# EAGLE schematic DAWA 6.1 (EAGLE 9.2.1)
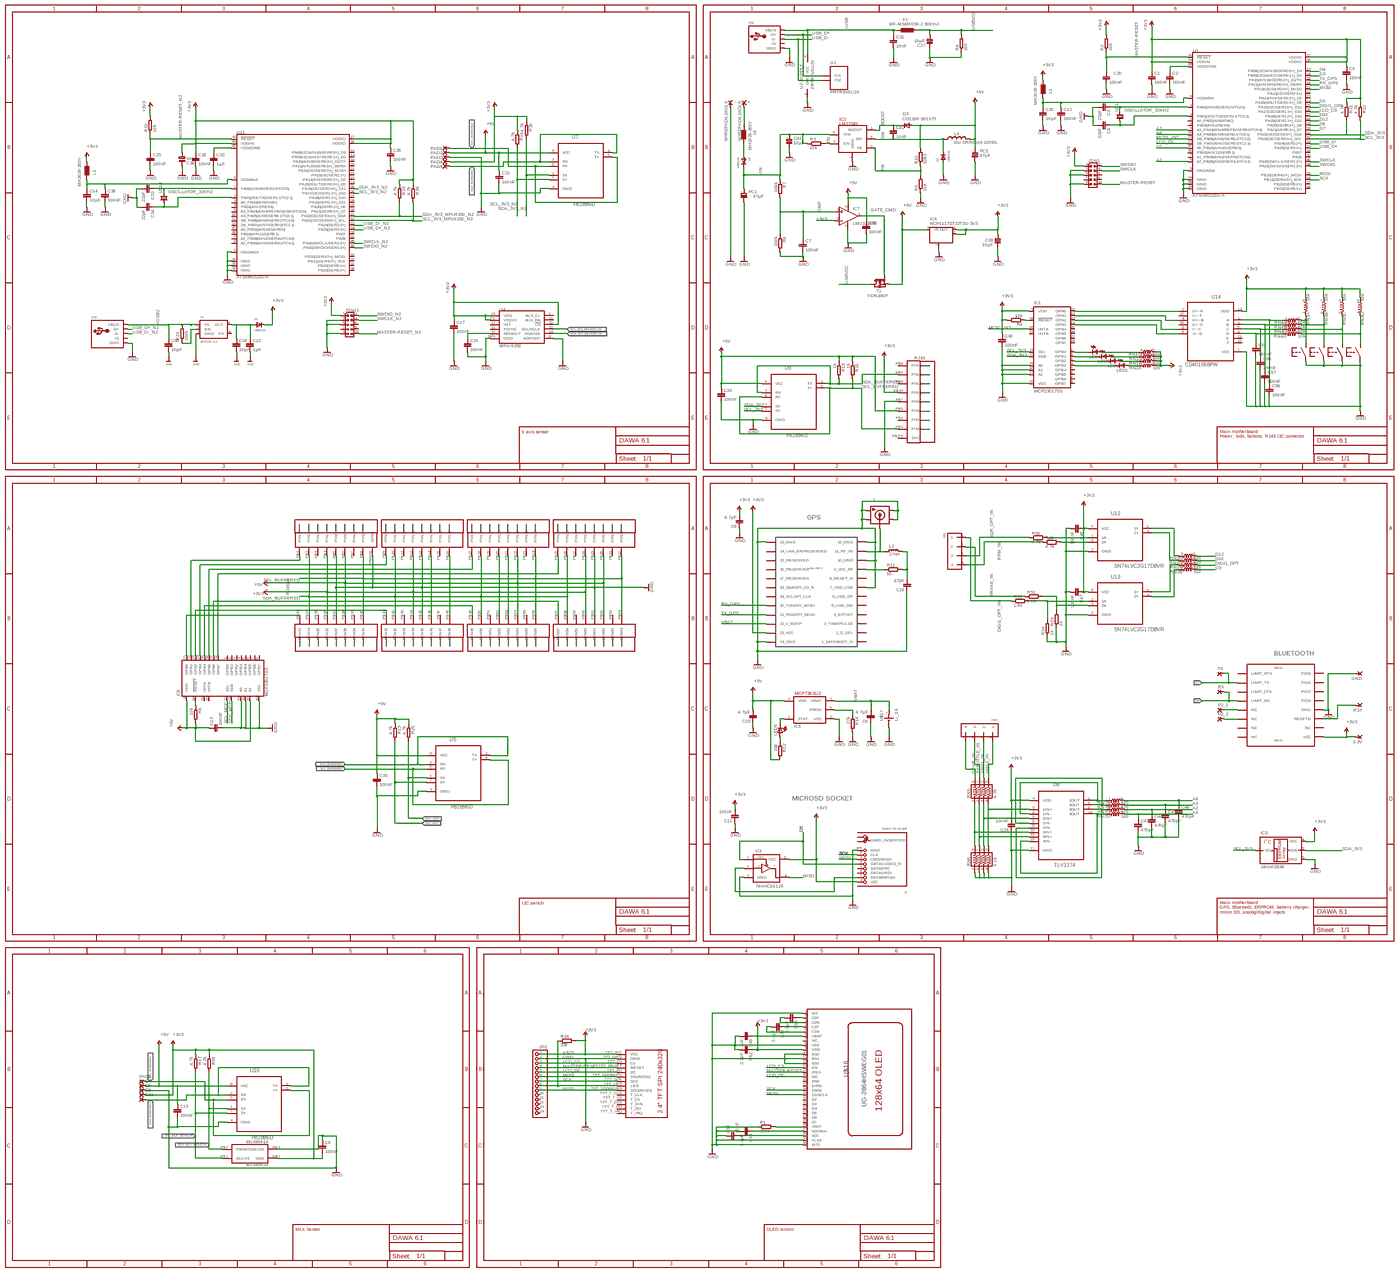
[diagram p0: schematic, sheet 1, overview]
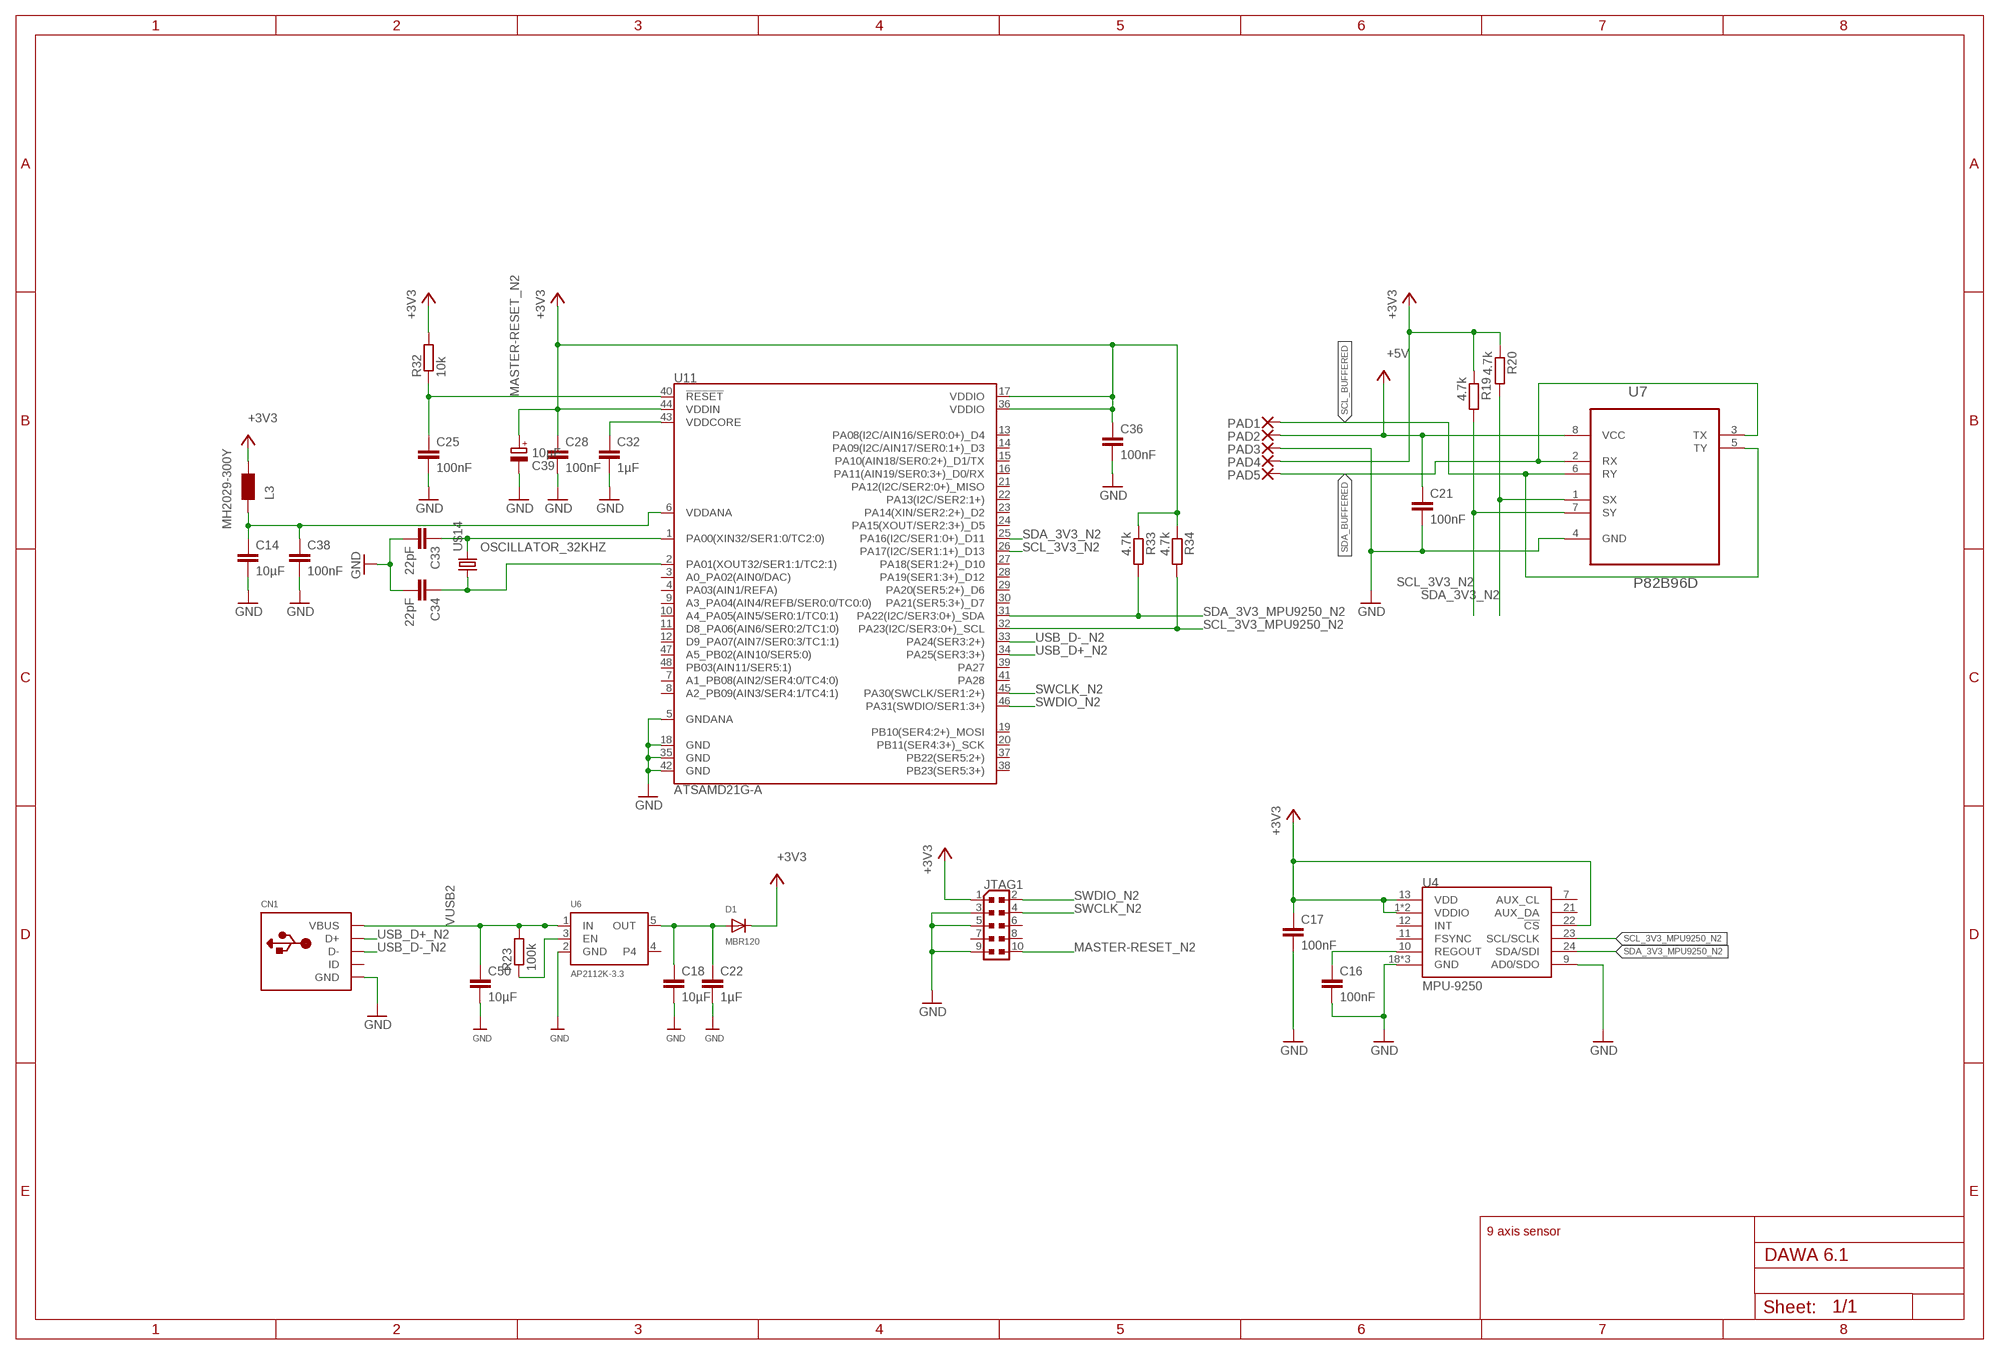
[diagram p1: schematic, sheet 1, part 1 of 4]
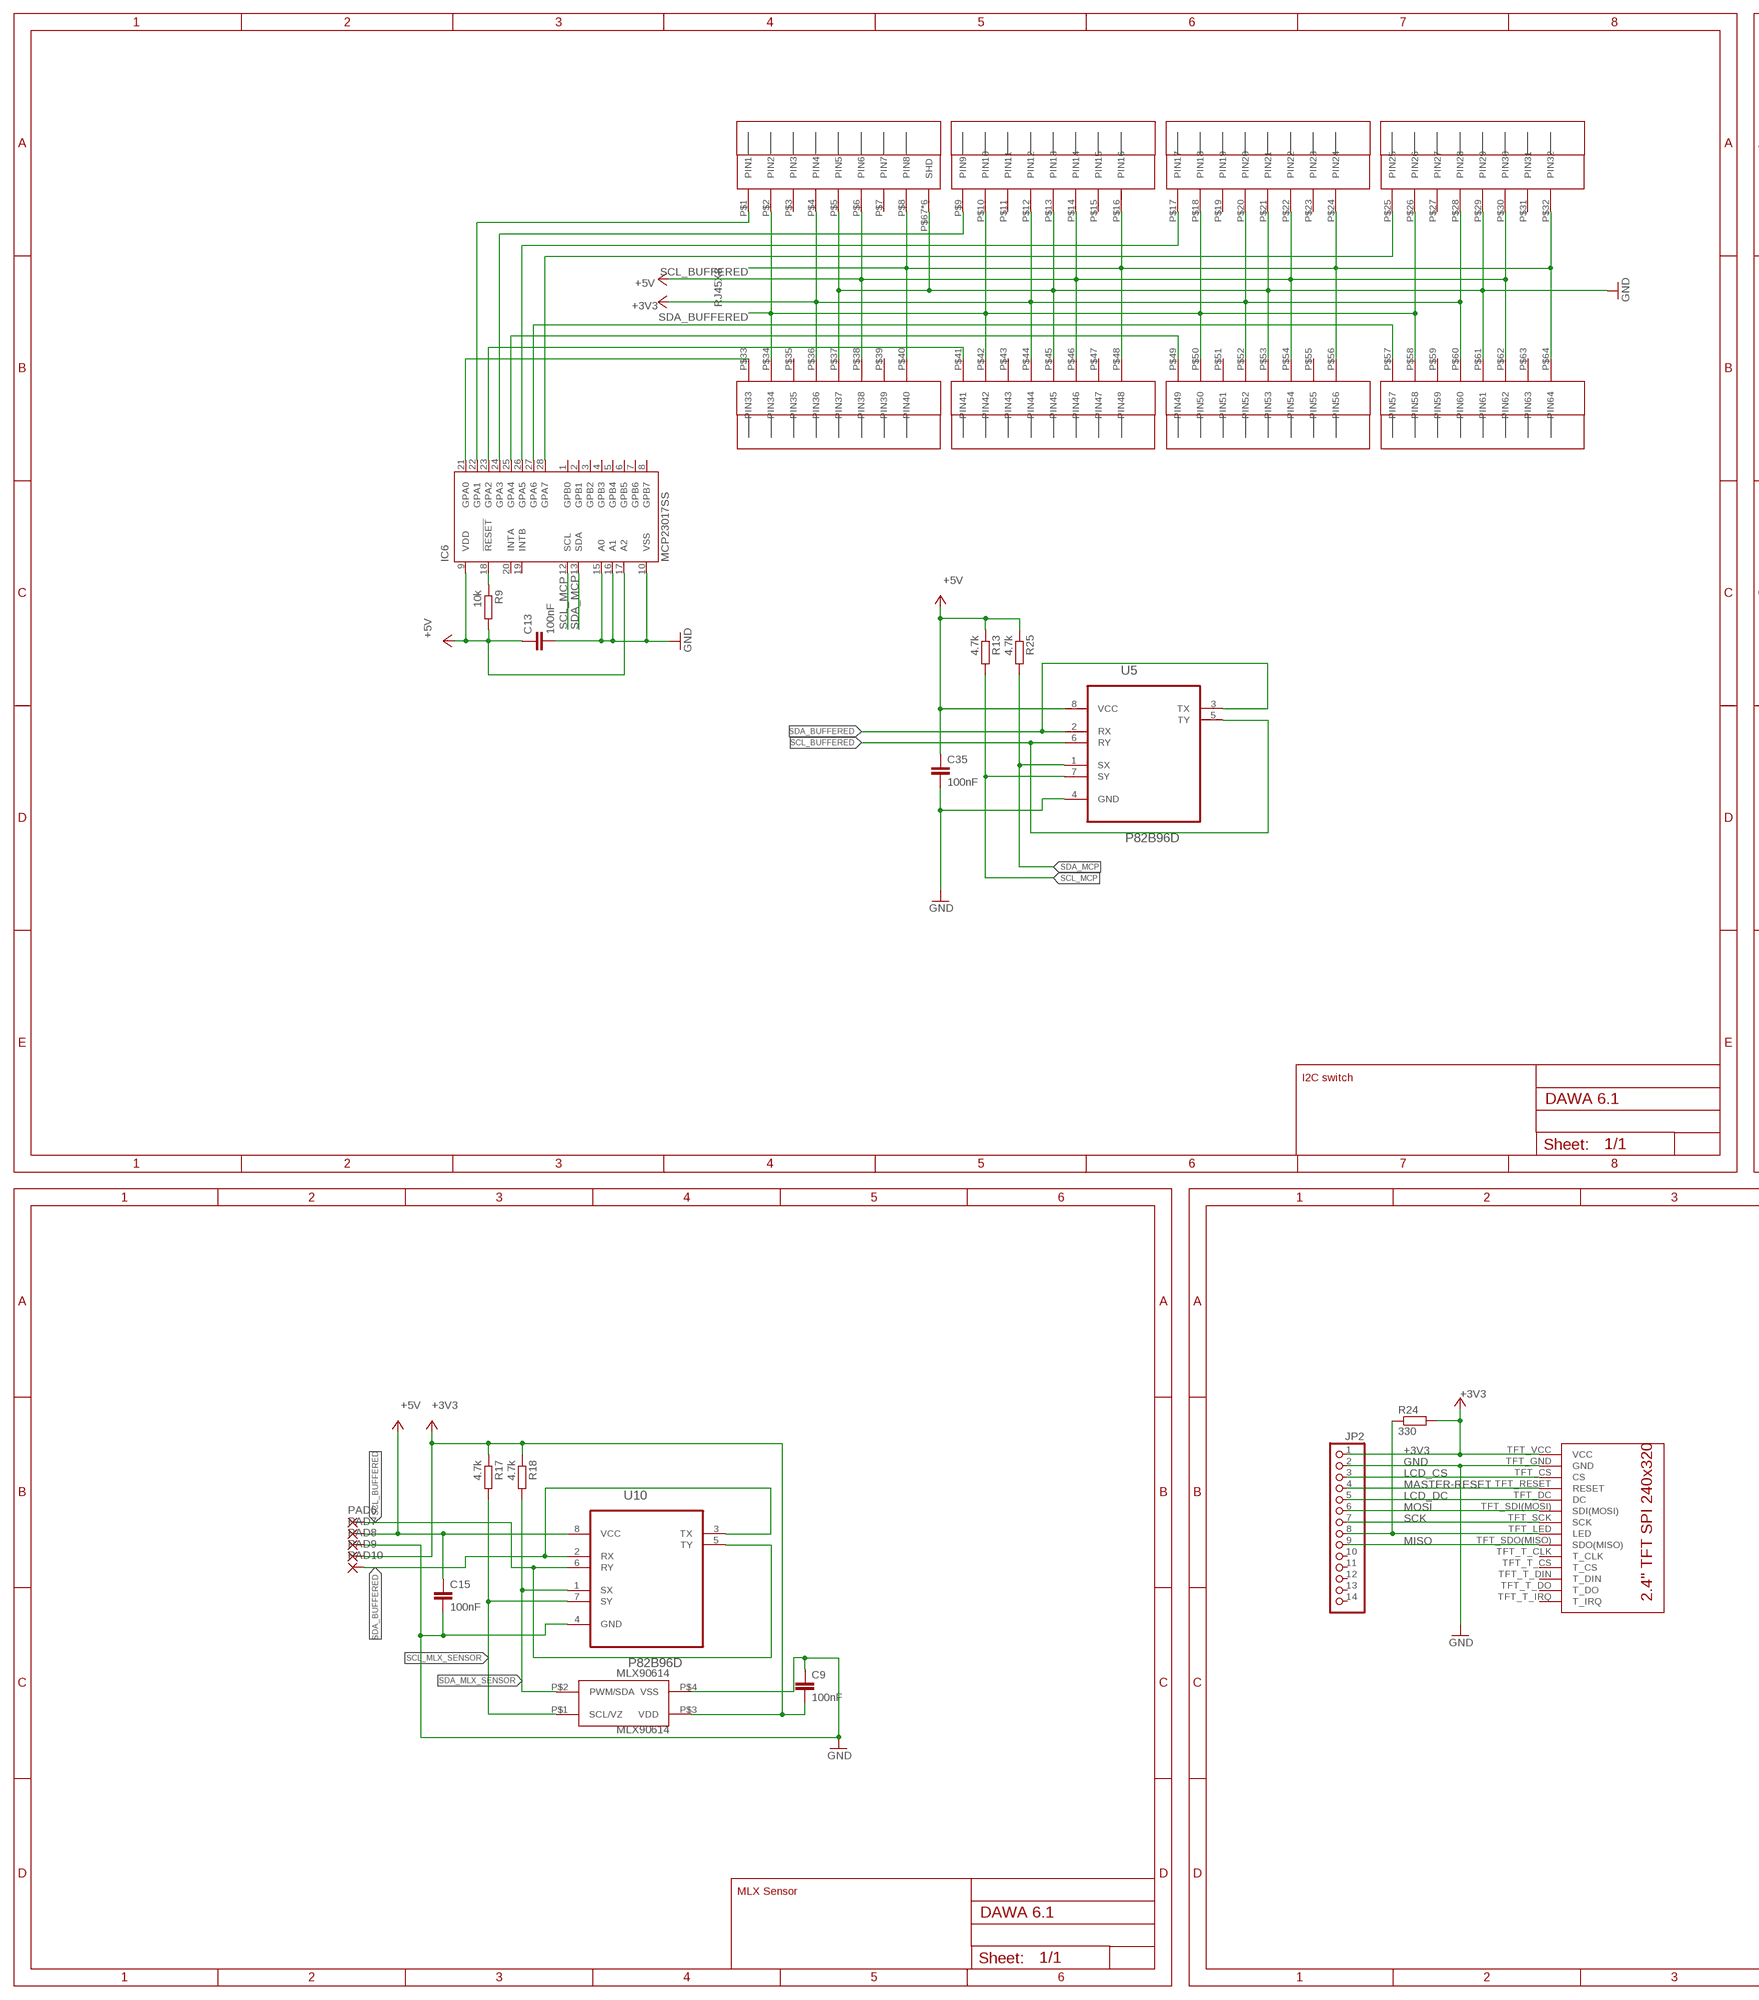
[diagram p2: schematic, sheet 1, part 2 of 4]
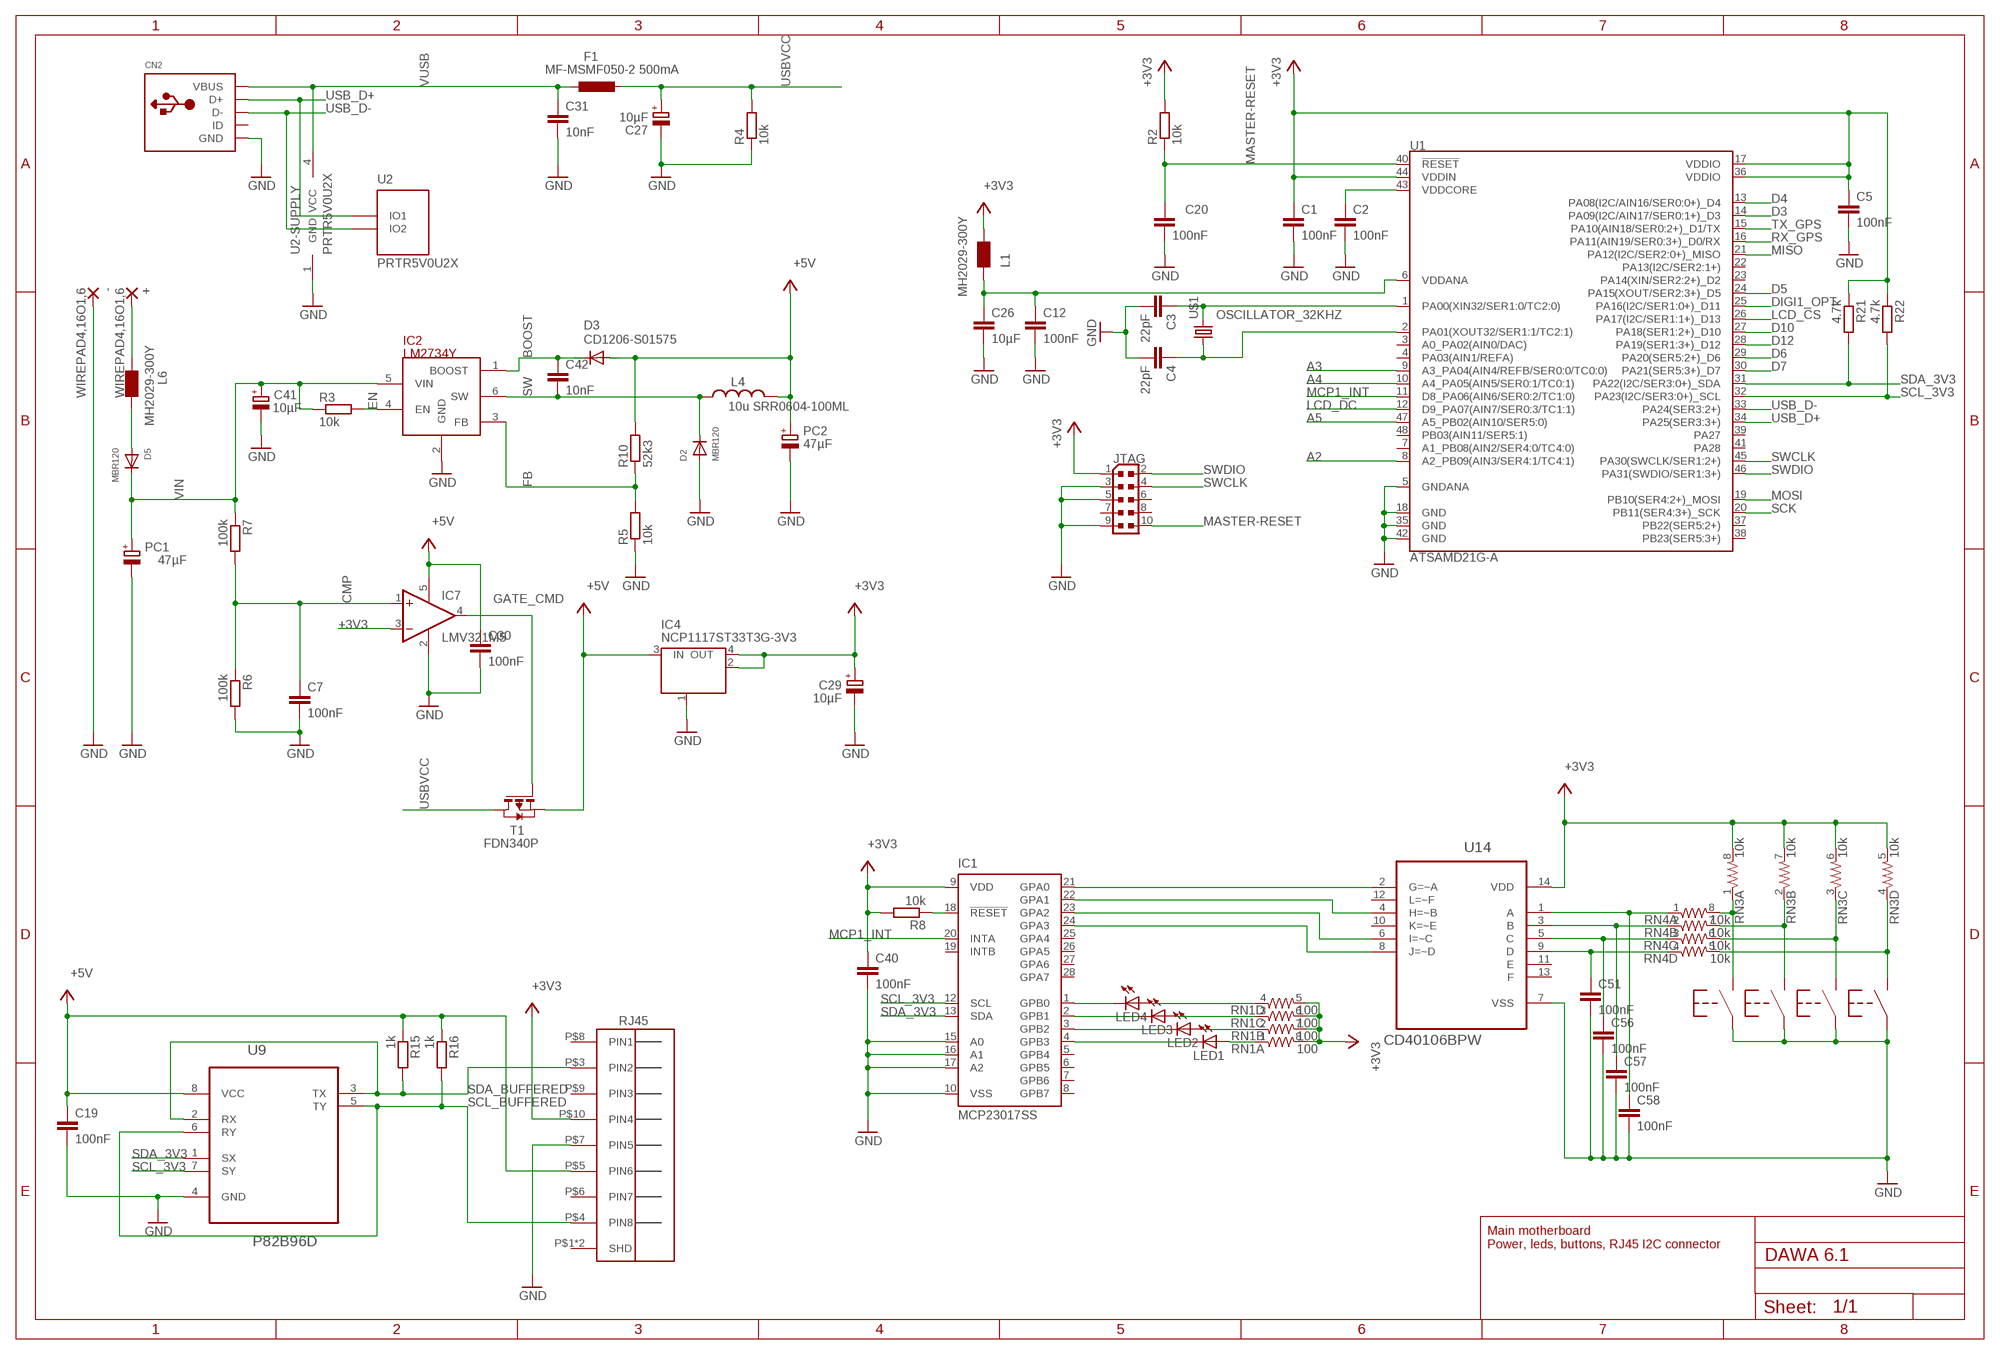
[diagram p3: schematic, sheet 1, part 3 of 4]
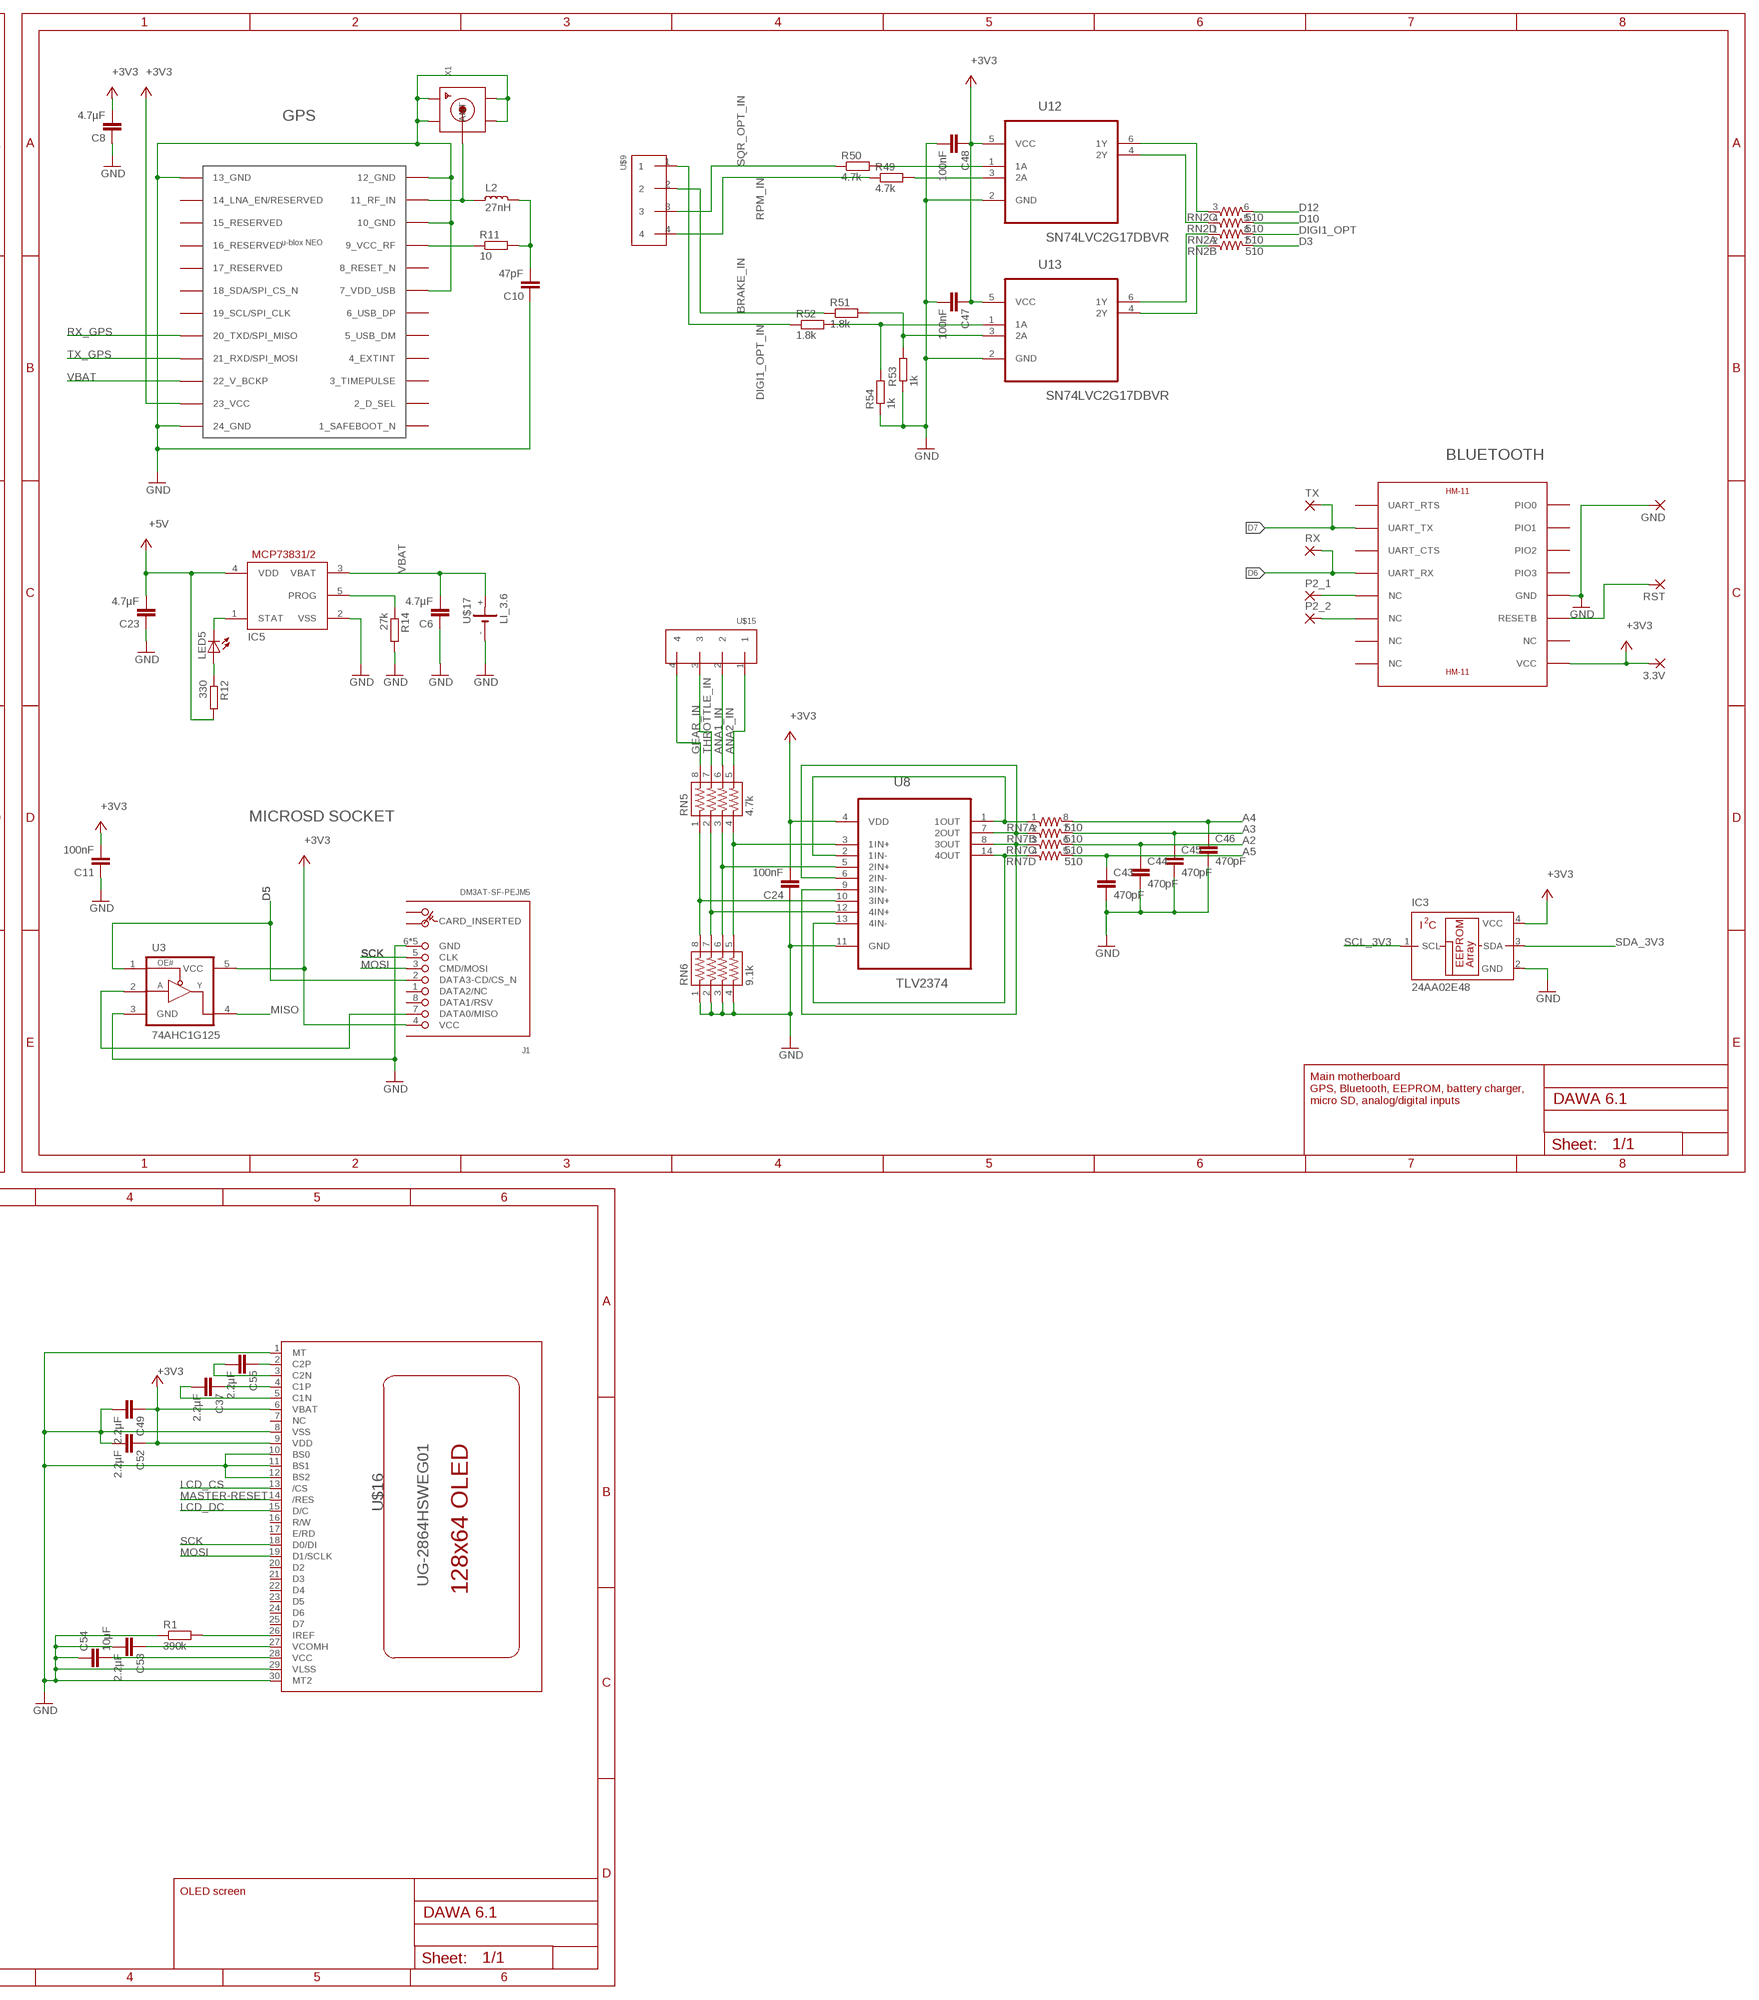
[diagram p4: schematic, sheet 1, part 4 of 4]

## Parts
3.3V  WIREPADSMD1,27-254  [SMD1,27-2,54]
+  WIREPAD4,16O1,6  [4,16O1,6]
-  WIREPAD4,16O1,6  [4,16O1,6]
C1  100nF  C-EUC0603  [C0603]
C2  100nF  C-EUC0603  [C0603]
C3  22pF  C-EUC0603  [C0603]
C4  22pF  C-EUC0603  [C0603]
C5  100nF  C-EUC0603  [C0603]
C6  4.7µF  C-EUC0603  [C0603]
C7  100nF  C-EUC0603  [C0603]
C8  4.7µF  C-EUC0603  [C0603]
C9  100nF  C-EUC0603  [C0603]
C10  47pF  C-EUC0603  [C0603]
C11  100nF  C-EUC0603  [C0603]
C12  100nF  C-EUC0603  [C0603]
C13  100nF  C-EUC0603  [C0603]
C14  10µF  C-EUC0805  [C0805]
C15  100nF  C-EUC0603  [C0603]
C16  100nF  C-EUC0603  [C0603]
C17  100nF  C-EUC0603  [C0603]
C18  10µF  C-EUC0603  [C0603]
C19  100nF  C-EUC0603  [C0603]
C20  100nF  C-EUC0603  [C0603]
C21  100nF  C-EUC0603  [C0603]
C22  1µF  C-EUC0603  [C0603]
C23  4.7µF  C-EUC0603  [C0603]
C24  100nF  C-EUC0603  [C0603]
C25  100nF  C-EUC0603  [C0603]
C26  10µF  C-EUC0805  [C0805]
C27  10µF  CPOL-EUSMCB  [SMC_B]
C28  100nF  C-EUC0603  [C0603]
C29  10µF  CPOL-EUSMCB  [SMC_B]
C30  100nF  C-EUC0603  [C0603]
C31  10nF  C-EUC0603  [C0603]
C32  1µF  C-EUC0603  [C0603]
C33  22pF  C-EUC0603  [C0603]
C34  22pF  C-EUC0603  [C0603]
C35  100nF  C-EUC0603  [C0603]
C36  100nF  C-EUC0603  [C0603]
C37  2.2µF  C-EUC0603  [C0603]
C38  100nF  C-EUC0603  [C0603]
C39  10µF  CPOL-EUSMCB  [SMC_B]
C40  100nF  C-EUC0603  [C0603]
C41  10µF  CPOL-EUSMCB  [SMC_B]
C42  10nF  C-EUC0603  [C0603]
C43  470pF  C-EUC0603  [C0603]
C44  470pF  C-EUC0603  [C0603]
C45  470pF  C-EUC0603  [C0603]
C46  470pF  C-EUC0603  [C0603]
C47  100nF  C-EUC0603  [C0603]
C48  100nF  C-EUC0603  [C0603]
C49  2.2µF  C-EUC0603  [C0603]
C50  10µF  C-EUC0603  [C0603]
C51  100nF  C-EUC0603  [C0603]
C52  2.2µF  C-EUC0603  [C0603]
C53  2.2µF  C-EUC0603  [C0603]
C54  10µF  C-EUC0805  [C0805]
C55  2.2µF  C-EUC0603  [C0603]
C56  100nF  C-EUC0603  [C0603]
C57  100nF  C-EUC0603  [C0603]
C58  100nF  C-EUC0603  [C0603]
CN1  USB  [USB-MINIB-DAWA]
CN2  USB  [USB-MINIB-DAWA]
D1  MBR120  DIODE_SOD-123FL  [SOD-123FL]
D2  MBR120  DIODE_SOD-123FL  [SOD-123FL]
D3  CD1206-S01575  DIODE-MINIMELF  [MINIMELF]
D5  MBR120  DIODE_SOD-123FL  [SOD-123FL]
F1  MF-MSMF050-2 500mA  L-EUL1812  [L1812]
GND  WIREPADSMD1,27-254  [SMD1,27-2,54]
IC1  MCP23017SS  [SSOP28]
IC2  LM2734Y  LM2736Y  [SOT23-6]
IC3  24AA02E48  24AA00OT  [SOT23-5L]
IC4  NCP1117ST33T3G-3V3  MC33269ST-3.3T3  [SOT223]
IC5  MCP73831/OT  [SOT23-5L]
IC6  MCP23017SS  [SSOP28]
IC7  LMV321M5  [SOT23-5]
J1  DM3AT-SF-PEJM5  [DM3AT-SF-PEJM5]
JP2  PINHD-1X14-CB  [1X14-CB]
JTAG  PINHEAD_PINHD-2X5PASSO127  [PINHEAD_2X05_127]
JTAG1  PINHEAD_PINHD-2X5PASSO127  [PINHEAD_2X05_127]
L1  MH2029-300Y  WE-CBF_0805  [0805]
L2  27nH  L_0603  [L0603]
L3  MH2029-300Y  WE-CBF_0805  [0805]
L4  10u SRR0604-100ML  L-USSRR0604  [SRR0604]
L6  MH2029-300Y  WE-CBF_0805  [0805]
LED1  LEDCHIPLED_1206  [CHIPLED_1206]
LED2  LEDCHIPLED_1206  [CHIPLED_1206]
LED3  LEDCHIPLED_1206  [CHIPLED_1206]
LED4  LEDCHIPLED_1206  [CHIPLED_1206]
LED5  LEDCHIPLED_1206  [CHIPLED_1206]
MLX90614  MLX90614  MLX90614_  [TO-39]
P2_1  WIREPADSMD1,27-254  [SMD1,27-2,54]
P2_2  WIREPADSMD1,27-254  [SMD1,27-2,54]
PAD1  WIREPAD1,6/0,9  [1,6/0,9]
PAD2  WIREPAD1,6/0,9  [1,6/0,9]
PAD3  WIREPAD1,6/0,9  [1,6/0,9]
PAD4  WIREPAD1,6/0,9  [1,6/0,9]
PAD5  WIREPAD1,6/0,9  [1,6/0,9]
PAD6  WIREPAD1,6/0,9  [1,6/0,9]
PAD7  WIREPAD1,6/0,9  [1,6/0,9]
PAD8  WIREPAD1,6/0,9  [1,6/0,9]
PAD9  WIREPAD1,6/0,9  [1,6/0,9]
PAD10  WIREPAD1,6/0,9  [1,6/0,9]
PC1  47µF  CPOL-EUD  [PANASONIC_D]
PC2  47µF  CPOL-EUD  [PANASONIC_D]
R1  390k  R-EU_R0603  [R0603]
R2  10k  R-EU_R0603  [R0603]
R3  10k  R-EU_R0603  [R0603]
R4  10k  R-EU_R0603  [R0603]
R5  10k  R-EU_R0603  [R0603]
R6  100k  R-EU_R0603  [R0603]
R7  100k  R-EU_R0603  [R0603]
R8  10k  R-EU_R0603  [R0603]
R9  10k  R-EU_R0603  [R0603]
R10  52k3  R-EU_R0603  [R0603]
R11  10  R-EU_R0603  [R0603]
R12  330  R-EU_R0603  [R0603]
R13  4.7k  R-EU_R0603  [R0603]
R14  27k  R-EU_R0603  [R0603]
R15  1k  R-EU_R0603  [R0603]
R16  1k  R-EU_R0603  [R0603]
R17  4.7k  R-EU_R0603  [R0603]
R18  4.7k  R-EU_R0603  [R0603]
R19  4.7k  R-EU_R0603  [R0603]
R20  4.7k  R-EU_R0603  [R0603]
R21  4.7k  R-EU_R0603  [R0603]
R22  4.7k  R-EU_R0603  [R0603]
R23  100k  R-EU_R0603  [R0603]
R24  330  R-EU_R0603  [R0603]
R25  4.7k  R-EU_R0603  [R0603]
R32  10k  R-EU_R0603  [R0603]
R33  4.7k  R-EU_R0603  [R0603]
R34  4.7k  R-EU_R0603  [R0603]
R49  4.7k  R-EU_R0603  [R0603]
R50  4.7k  R-EU_R0603  [R0603]
R51  1.8k  R-EU_R0603  [R0603]
R52  1.8k  R-EU_R0603  [R0603]
R53  1k  R-EU_R0603  [R0603]
R54  1k  R-EU_R0603  [R0603]
RJ45_MAIN_BOARD  RJ45  [RJ45]
RN1  100  742-8_SNS  [742-8NS]
RN2  510  742-8_SNS  [742-8NS]
RN3  10k  742-8_SNS  [742-8NS]
RN4  10k  742-8_SNS  [742-8NS]
RN5  4.7k  742-8NS  [742-8NS]
RN6  9.1k  742-8NS  [742-8NS]
RN7  510  742-8_SNS  [742-8NS]
RST  WIREPADSMD1,27-254  [SMD1,27-2,54]
RX  WIREPADSMD1,27-254  [SMD1,27-2,54]
T1  FDN340P  PMOSSOT23  [SOT-23]
TX  WIREPADSMD1,27-254  [SMD1,27-2,54]
U1  ATSAMD21G-A  [TQFP-48]
U2  PRTR5V0U2X  [SOT-143B]
U3  74AHC1G125  74AHC1G125DBV  [SOT23-5]
U4  MPU-9250  [QFN24_PAD]
U5  P82B96D  [SOIC127P600X175-8N]
U6  AP2112K-3.3  VREG_SOT23-5  [SOT23-5]
U7  P82B96D  [SOIC127P600X175-8N]
U8  TLV2374  TLV2374IPWR  [SOP65P640X120-14N]
U9  P82B96D  [SOIC127P600X175-8N]
U10  P82B96D  [SOIC127P600X175-8N]
U11  ATSAMD21G-A  [TQFP-48]
U12  SN74LVC2G17DBVR  [SOT95P280X145-6N]
U13  SN74LVC2G17DBVR  [SOT95P280X145-6N]
U14  CD40106BPW  [SOP65P640X120-14N]
U$1  OSCILLATOR_32KHZ  [OSCILLATOR_SMD]
U$2  HM-11  [HM-11]
U$3  NEO-M8  [NEO-M8]
U$4  TFT_2.4  [TFT_2.4]
U$5  SKPMAPE10  [SKPMAPE10]
U$6  SKPMAPE10  [SKPMAPE10]
U$7  SKPMAPE10  [SKPMAPE10]
U$8  SKPMAPE10  [SKPMAPE10]
U$9  4_PIN_JST-XH-SMD  [4_PIN_JST-XH-SMD]
U$14  OSCILLATOR_32KHZ  [OSCILLATOR_SMD]
U$15  4_PIN_JST-XH-SMD  [4_PIN_JST-XH-SMD]
U$16  UG-2864HSWEG01  [1X30-0.7MM]
U$17  LI_3.6  [LI_3.6]
U$18  RJ45X8  [RJ45X8]
X1  SMACONNECTOR_EDGE  [SMA_EDGELAUNCH]

## Nets
+3V3: 3.3V.1(P) C1.1 C5.1 C8.2 C9.2 C11.2 C17.1 C24.2 C28.1 C29.+ C36.1 C39.+ C40.1 C47.1 C48.1 C49.1 C52.1 D1.C IC1.9(VDD) IC3.4(VCC) IC4.2(OUT) IC4.4(OUT) IC7.3(-IN) J1.4(VCC) JP2.1 JTAG1.1 JTAG.1 L1.1 L3.1 MLX90614.P$3(VDD) PAD4.1(P) PAD9.1(P) R2.2 R8.2 R17.1 R18.1 R19.1 R20.1 R21.1 R22.1 R24.2 R32.2 R33.1 R34.1 RJ45_MAIN_BOARD.P$10(PIN4) RN1.5 RN1.6 RN1.7 RN1.8 RN3.5 RN3.6 RN3.7 RN3.8 U1.17(VDDIO) U1.36(VDDIO) U1.44(VDDIN) U3.5(VCC) U4.1(VDDIO) U4.8(VDDIO) U4.13(VDD) U4.22(!CS) U8.4(VDD) U11.17(VDDIO) U11.36(VDDIO) U11.44(VDDIN) U12.5(VCC) U13.5(VCC) U14.14(VDD) U$2.VCC U$3.23(23_VCC) U$4.TFT_VCC(VCC) U$16.6(VBAT) U$16.9(VDD) U$18.P$4(PIN4) U$18.P$12(PIN12) U$18.P$20(PIN20) U$18.P$28(PIN28) U$18.P$36(PIN36) U$18.P$44(PIN44) U$18.P$52(PIN52) U$18.P$60(PIN60)
+5V: C13.1 C15.1 C19.1 C21.1 C23.2 C30.1 C35.1 D3.A IC4.3(IN) IC5.4(VDD) IC6.9(VDD) IC6.17(A2) IC7.5(V+) L4.P$2 PAD2.1(P) PAD7.1(P) PC2.+ R9.2 R10.2 R12.2 R13.1 R15.1 R16.1 R25.1 RJ45_MAIN_BOARD.P$5(PIN6) T1.2(S) U5.8(VCC) U7.8(VCC) U9.8(VCC) U10.8(VCC) U$18.P$6(PIN6) U$18.P$14(PIN14) U$18.P$22(PIN22) U$18.P$30(PIN30) U$18.P$38(PIN38) U$18.P$46(PIN46) U$18.P$54(PIN54) U$18.P$62(PIN62)
A2: C44.1 RN7.6 U1.8(A2_PB09(AIN3/SER4:1/TC4:1))
A3: C45.1 RN7.7 U1.9(A3_PA04(AIN4/REFB/SER0:0/TC0:0))
A4: C46.1 RN7.8 U1.10(A4_PA05(AIN5/SER0:1/TC0:1))
A5: C43.1 RN7.5 U1.47(A5_PB02(AIN10/SER5:0))
ALIM+: +.1(P) L6.2
ANA1_IN: RN5.6 U$15.2
ANA2_IN: RN5.5 U$15.1
BOOST: C42.1 D3.C IC2.1(BOOST)
BRAKE_IN: R51.1 U$9.2
CMP: C7.1 IC7.1(+IN) R6.1 R7.2
D3: RN2.7 U1.14(PA09(I2C/AIN17/SER0:1+)_D3)
D4: U1.13(PA08(I2C/AIN16/SER0:0+)_D4)
D5: J1.2(DATA3-CD/CS_N) U1.24(PA15(XOUT/SER2:3+)_D5) U3.1(OE#)
D6: RX.1(P) U1.29(PA20(SER5:2+)_D6) U$2.UART_RX
D7: TX.1(P) U1.30(PA21(SER5:3+)_D7) U$2.UART_TX
D10: RN2.5 U1.27(PA18(SER1:2+)_D10)
D12: RN2.6 U1.28(PA19(SER1:3+)_D12)
DIGI1_OPT: RN2.8 U1.25(PA16(I2C/SER1:0+)_D11)
DIGI1_OPT_IN: R52.1 U$9.1
EN: IC2.4(EN) R3.2
FB: IC2.3(FB) R5.2 R10.1
GATE_CMD: IC7.4(OUT) T1.3(G)
GEAR_IN: RN5.8 U$15.4
GND: -.1(P) C1.2 C2.2 C3.2 C4.2 C5.2 C6.1 C7.2 C8.1 C9.1 C10.1 C11.1 C12.2 C13.2 C14.2 C15.2 C16.2 C17.2 C18.2 C19.2 C20.2 C21.2 C22.2 C23.1 C24.1 C25.2 C26.2 C27.- C28.2 C29.- C30.2 C31.2 C32.2 C33.2 C34.2 C35.2 C36.2 C38.2 C39.- C40.2 C41.- C43.2 C44.2 C45.2 C46.2 C47.2 C48.2 C49.2 C50.2 C51.2 C52.2 C53.2 C54.1 C56.2 C57.2 C58.2 CN1.GND CN1.GND1(GND) CN1.GND2(GND) CN2.GND CN2.GND1(GND) CN2.GND2(GND) D2.A GND.1(P) IC1.10(VSS) IC1.15(A0) IC1.16(A1) IC1.17(A2) IC2.2(GND) IC3.2(GND) IC4.1(GND/ADJ) IC5.2(VSS) IC6.10(VSS) IC6.15(A0) IC6.16(A1) IC7.2(V-) J1.6(GND) J1.MOUNT0(GND) J1.MOUNT1(GND) J1.MOUNT2(GND) J1.MOUNT3(GND) JP2.2 JTAG1.3 JTAG1.5 JTAG1.9 JTAG.3 JTAG.5 JTAG.9 MLX90614.P$4(VSS) PAD3.1(P) PAD8.1(P) PC1.- PC2.- R1.1 R4.1 R5.1 R6.2 R14.2 R53.1 R54.1 RJ45_MAIN_BOARD.P$7(PIN5) RN6.1 RN6.2 RN6.3 RN6.4 U1.5(GNDANA) U1.18(GND) U1.35(GND) U1.42(GND) U2.1(GND) U3.3(GND) U4.9(AD0/SDO) U4.18(GND) U4.20(GND) U4.CENTER(GND) U5.4(GND) U6.2(GND) U7.4(GND) U8.11(GND) U9.4(GND) U10.4(GND) U11.5(GNDANA) U11.18(GND) U11.35(GND) U11.42(GND) U12.2(GND) U13.2(GND) U14.7(VSS) U$2.GND U$3.7(7_VDD_USB) U$3.10(10_GND) U$3.12(12_GND) U$3.13(13_GND) U$3.24(24_GND) U$4.TFT_GND(GND) U$5.P$1 U$6.P$1 U$7.P$1 U$8.P$1 U$16.1(MT) U$16.8(VSS) U$16.10(BS0) U$16.11(BS1) U$16.12(BS2) U$16.29(VLSS) U$16.30(MT2) U$17.- U$18.P$5(PIN5) U$18.P$13(PIN13) U$18.P$21(PIN21) U$18.P$29(PIN29) U$18.P$37(PIN37) U$18.P$45(PIN45) U$18.P$53(PIN53) U$18.P$61(PIN61) U$18.P$67(SHD) U$18.P$68(SHD) U$18.P$69(SHD) U$18.P$70(SHD) U$18.P$71(SHD) U$18.P$72(SHD) X1.GND@1(GND4) X1.GND@2(GND3) X1.GND@3(GND2) X1.GND@4(GND1)
LCD_CS: JP2.3 U1.26(PA17(I2C/SER1:1+)_D13) U$4.TFT_CS(CS) U$16.13(/CS)
LCD_DC: JP2.5 U1.12(D9_PA07(AIN7/SER0:3/TC1:1)) U$4.TFT_DC(DC) U$16.15(D/C)
MASTER-RESET: C20.1 JP2.4 JTAG.10 R2.1 U1.40(!RESET!) U$4.TFT_RESET(RESET) U$16.14(/RES)
MASTER-RESET_N2: C25.1 JTAG1.10 R32.1 U11.40(!RESET!)
MCP1_INT: IC1.20(INTA) U1.11(D8_PA06(AIN6/SER0:2/TC1:0))
MISO: JP2.9 U1.21(PA12(I2C/SER2:0+)_MISO) U3.4(Y) U$4.TFT_SDO(MISO)(SDO(MISO))
MOSI: J1.3(CMD/MOSI) JP2.6 U1.19(PB10(SER4:2+)_MOSI) U$4.TFT_SDI(MOSI)(SDI(MOSI)) U$16.19(D1/SCLK)
N$1: C2.1 U1.43(VDDCORE)
N$2: C3.1 U1.1(PA00(XIN32/SER1:0/TC2:0)) U$1.2
N$3: C4.1 U1.2(PA01(XOUT32/SER1:1/TC2:1)) U$1.1
N$4: RN5.4 RN6.5 U8.3(1IN+)
N$5: IC1.1(GPB0) LED4.C
N$6: IC5.1(STAT) LED5.C
N$7: IC1.2(GPB1) LED3.C
N$8: LED5.A R12.1
N$9: C32.1 U11.43(VDDCORE)
N$10: D5.A L6.1
N$11: C10.2 L2.1 R11.2
N$12: IC5.5(PROG) R14.1
N$13: J1.7(DATA0/MISO) U3.2(A)
N$14: P2_1.1(P) U$2.NC@5(NC)
N$15: RST.1(P) U$2.RESETB
N$16: C33.1 U11.1(PA00(XIN32/SER1:0/TC2:0)) U$14.2
N$17: C34.1 U11.2(PA01(XOUT32/SER1:1/TC2:1)) U$14.1
N$18: P2_2.1(P) U$2.NC@6(NC)
N$19: R11.1 U$3.9(9_VCC_RF)
N$20: L2.2 U$3.11(11_RF_IN) X1.P(ANT)
N$21: RN5.3 RN6.6 U8.5(2IN+)
N$22: IC1.3(GPB2) LED2.C
N$23: IC1.4(GPB3) LED1.C
N$24: RN7.1 U8.1(1OUT) U8.2(1IN-)
N$25: RN7.2 U8.6(2IN-) U8.7(2OUT)
N$26: RN7.3 U8.8(3OUT) U8.9(3IN-)
N$27: RN7.4 U8.13(4IN-) U8.14(4OUT)
N$28: RN5.2 RN6.7 U8.12(4IN+)
N$29: LED4.A RN1.4
N$30: LED3.A RN1.3
N$31: RN5.1 RN6.8 U8.10(3IN+)
N$32: LED2.A RN1.2
N$33: LED1.A RN1.1
N$34: IC1.18(!RESET) R8.1
N$35: IC6.28(GPA7) U$18.P$25(PIN25)
N$36: RN2.3 U12.6(1Y)
N$37: RN3.4 RN4.5 U$5.P$2
N$38: RN3.3 RN4.6 U$6.P$2
N$39: IC6.26(GPA5) U$18.P$17(PIN17)
N$40: IC6.24(GPA3) U$18.P$9(PIN9)
N$41: R50.2 U12.1(1A)
N$42: R49.2 U12.3(2A)
N$43: R51.2 R53.2 U13.3(2A)
N$44: R52.2 R54.2 U13.1(1A)
N$45: RN2.1 U13.6(1Y)
N$46: RN2.2 U13.4(2Y)
N$47: R23.1 U6.3(EN)
N$48: JP2.8 R24.1 U$4.TFT_LED(LED)
N$49: RN2.4 U12.4(2Y)
N$50: RN3.1 RN4.8 U$8.P$2
N$51: RN3.2 RN4.7 U$7.P$2
N$52: IC6.22(GPA1) U$18.P$1(PIN1)
N$53: IC6.21(GPA0) U$18.P$33(PIN33)
N$54: IC6.23(GPA2) U$18.P$41(PIN41)
N$55: IC6.25(GPA4) U$18.P$49(PIN49)
N$56: IC6.27(GPA6) U$18.P$57(PIN57)
N$57: IC6.18(!RESET) R9.1
N$58: IC1.21(GPA0) U14.2(G=~A)
N$59: IC1.22(GPA1) U14.4(H=~B)
N$60: R1.2 U$16.26(IREF)
N$61: C55.1 U$16.2(C2P)
N$62: C55.2 U$16.3(C2N)
N$63: C37.1 U$16.4(C1P)
N$64: C37.2 U$16.5(C1N)
N$65: C54.2 U$16.28(VCC)
N$66: C53.1 U$16.27(VCOMH)
N$67: IC1.23(GPA2) U14.6(I=~C)
N$68: IC1.24(GPA3) U14.8(J=~D)
N$69: C51.1 RN4.4 U14.9(D)
N$70: C56.1 RN4.3 U14.5(C)
N$71: C57.1 RN4.2 U14.3(B)
N$72: C58.1 RN4.1 U14.1(A)
OUT: C18.1 C22.1 D1.A U6.5(OUT)
REGOUT: C16.1 U4.10(REGOUT)
RPM_IN: R49.1 U$9.4
RX_GPS: U1.16(PA11(AIN19/SER0:3+)_D0/RX) U$3.20(20_TXD/SPI_MISO)
SCK: J1.5(CLK) JP2.7 U1.20(PB11(SER4:3+)_SCK) U$4.TFT_SCK(SCK) U$16.18(D0/DI)
SCL_3V3: IC1.12(SCL) IC3.1(SCL) R22.2 U1.32(PA23(I2C/SER3:0+)_SCL) U9.7(SY)
SCL_3V3_MPU9250_N2: R34.2 U4.23(SCL/SCLK) U11.32(PA23(I2C/SER3:0+)_SCL)
SCL_3V3_N2: R19.2 U7.7(SY) U11.26(PA17(I2C/SER1:1+)_D13)
SCL_BUFFERED: PAD1.1(P) PAD6.1(P) R16.2 RJ45_MAIN_BOARD.P$4(PIN8) U5.5(TY) U5.6(RY) U7.5(TY) U7.6(RY) U9.5(TY) U9.6(RY) U10.5(TY) U10.6(RY) U$18.P$8(PIN8) U$18.P$16(PIN16) U$18.P$24(PIN24) U$18.P$32(PIN32) U$18.P$40(PIN40) U$18.P$48(PIN48) U$18.P$56(PIN56) U$18.P$64(PIN64)
SCL_MCP: IC6.12(SCL) R13.2 U5.7(SY)
SCL_MLX_SENSOR: MLX90614.P$1(SCL/VZ) R17.2 U10.7(SY)
SDA_3V3: IC1.13(SDA) IC3.3(SDA) R21.2 U1.31(PA22(I2C/SER3:0+)_SDA) U9.1(SX)
SDA_3V3_MPU9250_N2: R33.2 U4.24(SDA/SDI) U11.31(PA22(I2C/SER3:0+)_SDA)
SDA_3V3_N2: R20.2 U7.1(SX) U11.25(PA16(I2C/SER1:0+)_D11)
SDA_BUFFERED: PAD5.1(P) PAD10.1(P) R15.2 RJ45_MAIN_BOARD.P$3(PIN2) U5.2(RX) U5.3(TX) U7.2(RX) U7.3(TX) U9.2(RX) U9.3(TX) U10.2(RX) U10.3(TX) U$18.P$2(PIN2) U$18.P$10(PIN10) U$18.P$18(PIN18) U$18.P$26(PIN26) U$18.P$34(PIN34) U$18.P$42(PIN42) U$18.P$50(PIN50) U$18.P$58(PIN58)
SDA_MCP: IC6.13(SDA) R25.2 U5.1(SX)
SDA_MLX_SENSOR: MLX90614.P$2(PWM/SDA) R18.2 U10.1(SX)
SQR_OPT_IN: R50.1 U$9.3
SW: C42.2 D2.C IC2.6(SW) L4.P$1
SWCLK: JTAG.4 U1.45(PA30(SWCLK/SER1:2+))
SWCLK_N2: JTAG1.4 U11.45(PA30(SWCLK/SER1:2+))
SWDIO: JTAG.2 U1.46(PA31(SWDIO/SER1:3+))
SWDIO_N2: JTAG1.2 U11.46(PA31(SWDIO/SER1:3+))
THROTTLE_IN: RN5.7 U$15.3
TX_GPS: U1.15(PA10(AIN18/SER0:2+)_D1/TX) U$3.21(21_RXD/SPI_MOSI)
USB_D+: CN2.D+ U1.34(PA25(SER3:3+)) U2.2(IO1)
USB_D+_N2: CN1.D+ U11.34(PA25(SER3:3+))
USB_D-: CN2.D- U1.33(PA24(SER3:2+)) U2.3(IO2)
USB_D-_N2: CN1.D- U11.33(PA24(SER3:2+))
USBVCC: C27.+ F1.1 R4.2 T1.1(D)
VBAT: C6.2 IC5.3(VBAT) U$3.22(22_V_BCKP) U$17.+
VDDANA: C12.1 C26.1 L1.2 U1.6(VDDANA)
VDDANA1: C14.1 C38.1 L3.2 U11.6(VDDANA)
VIN: C41.+ D5.C IC2.5(VIN) PC1.+ R3.1 R7.1
VUSB [usbvcc]: C31.1 CN2.VBUS F1.2 U2.4(VCC)
VUSB2: C50.1 CN1.VBUS R23.2 U6.1(IN)
Unconnected: CN1.ID CN2.ID IC1.5(GPB4) IC1.6(GPB5) IC1.7(GPB6) IC1.8(GPB7) IC1.19(INTB) IC1.25(GPA4) IC1.26(GPA5) IC1.27(GPA6) IC1.28(GPA7) IC6.1(GPB0) IC6.2(GPB1) IC6.3(GPB2) IC6.4(GPB3) IC6.5(GPB4) IC6.6(GPB5) IC6.7(GPB6) IC6.8(GPB7) IC6.19(INTB) IC6.20(INTA) J1.1(DATA2/NC) J1.8(DATA1/RSV) J1.A J1.B JP2.10 JP2.11 JP2.12 JP2.13 JP2.14 JTAG1.6 JTAG1.7 JTAG1.8 JTAG.6 JTAG.7 JTAG.8 RJ45_MAIN_BOARD.P$1(SHD) RJ45_MAIN_BOARD.P$2(SHD) RJ45_MAIN_BOARD.P$6(PIN7) RJ45_MAIN_BOARD.P$8(PIN1) RJ45_MAIN_BOARD.P$9(PIN3) U1.3(A0_PA02(AIN0/DAC)) U1.4(PA03(AIN1/REFA)) U1.7(A1_PB08(AIN2/SER4:0/TC4:0)) U1.22(PA13(I2C/SER2:1+)) U1.23(PA14(XIN/SER2:2+)_D2) U1.37(PB22(SER5:2+)) U1.38(PB23(SER5:3+)) U1.39(PA27) U1.41(PA28) U1.48(PB03(AIN11/SER5:1)) U4.7(AUX_CL) U4.11(FSYNC) U4.12(INT) U4.21(AUX_DA) U6.4 U11.3(A0_PA02(AIN0/DAC)) U11.4(PA03(AIN1/REFA)) U11.7(A1_PB08(AIN2/SER4:0/TC4:0)) U11.8(A2_PB09(AIN3/SER4:1/TC4:1)) U11.9(A3_PA04(AIN4/REFB/SER0:0/TC0:0)) U11.10(A4_PA05(AIN5/SER0:1/TC0:1)) U11.11(D8_PA06(AIN6/SER0:2/TC1:0)) U11.12(D9_PA07(AIN7/SER0:3/TC1:1)) U11.13(PA08(I2C/AIN16/SER0:0+)_D4) U11.14(PA09(I2C/AIN17/SER0:1+)_D3) U11.15(PA10(AIN18/SER0:2+)_D1/TX) U11.16(PA11(AIN19/SER0:3+)_D0/RX) U11.19(PB10(SER4:2+)_MOSI) U11.20(PB11(SER4:3+)_SCK) U11.21(PA12(I2C/SER2:0+)_MISO) U11.22(PA13(I2C/SER2:1+)) U11.23(PA14(XIN/SER2:2+)_D2) U11.24(PA15(XOUT/SER2:3+)_D5) U11.27(PA18(SER1:2+)_D10) U11.28(PA19(SER1:3+)_D12) U11.29(PA20(SER5:2+)_D6) U11.30(PA21(SER5:3+)_D7) U11.37(PB22(SER5:2+)) U11.38(PB23(SER5:3+)) U11.39(PA27) U11.41(PA28) U11.47(A5_PB02(AIN10/SER5:0)) U11.48(PB03(AIN11/SER5:1)) U14.10(K=~E) U14.11(E) U14.12(L=~F) U14.13(F) U$2.NC@7(NC) U$2.NC@8(NC) U$2.NC@10(NC) U$2.PIO0 U$2.PIO1 U$2.PIO2 U$2.PIO3 U$2.UART_CTS U$2.UART_RTS U$3.1(1_SAFEBOOT_N) U$3.2(2_D_SEL) U$3.3(3_TIMEPULSE) U$3.4(4_EXTINT) U$3.5(5_USB_DM) U$3.6(6_USB_DP) U$3.8(8_RESET_N) U$3.14(14_LNA_EN/RESERVED) U$3.15(15_RESERVED) U$3.16(16_RESERVED) U$3.17(17_RESERVED) U$3.18(18_SDA/SPI_CS_N) U$3.19(19_SCL/SPI_CLK) U$4.TFT_T_CLK(T_CLK) U$4.TFT_T_CS(T_CS) U$4.TFT_T_DIN(T_DIN) U$4.TFT_T_DO(T_DO) U$4.TFT_T_IRQ(T_IRQ) U$16.7(NC) U$16.16(R/W) U$16.17(E/RD) U$16.20(D2) U$16.21(D3) U$16.22(D4) U$16.23(D5) U$16.24(D6) U$16.25(D7) U$18.P$3(PIN3) U$18.P$7(PIN7) U$18.P$11(PIN11) U$18.P$15(PIN15) U$18.P$19(PIN19) U$18.P$23(PIN23) U$18.P$27(PIN27) U$18.P$31(PIN31) U$18.P$35(PIN35) U$18.P$39(PIN39) U$18.P$43(PIN43) U$18.P$47(PIN47) U$18.P$51(PIN51) U$18.P$55(PIN55) U$18.P$59(PIN59) U$18.P$63(PIN63)

## Notes on the sheet
- 9 axis sensor
- Main motherboard
  Power, leds, buttons, RJ45 I2C connector
- GPS
- BLUETOOTH
- MICROSD SOCKET
- I2C switch
- Main motherboard
  GPS, Bluetooth, EEPROM, battery charger,
  micro SD, analog/digital inputs
- MLX Sensor | OLED screen

## Library data of the parts
3.3V + - GND P2_1 P2_2 PAD1-PAD10 RST RX TX = wirepad:WIREPAD: Wire PAD connect wire on PCB
C1-C5 C7 C12-C14 C16-C18 C20 C22 C25 C26 C28 C30-C34 C36-C38 C40 C42-C46 C49 C50 C52-C55 = rcl:C-EU: CAPACITOR, European symbol; SPICEPREFIX: C
C6 C8-C11 C15 C19 C21 C23 C24 C35 C47 C48 C51 C56-C58 = rcl:C-EU: CAPACITOR, European symbol
C27 C39 = rcl:CPOL-EU: POLARIZED CAPACITOR, European symbol
C29 C41 PC1 PC2 = rcl:CPOL-EU: POLARIZED CAPACITOR, European symbol; SPICEPREFIX: C
CN1 CN2 = DAWA:USB: USB Connectors USBMINIB - Surface Mount Female Mini-B USB Connector 4UConnector: 06564 By microbuilder.eu Thru-hole RA Female Mini-B USB Connector 4UConnector: 18732 By ladyada.net
D1 D2 D5 = adafruit:DIODE: Diode SMADIODE - SMA Surface Mount Package 20V 1A Schottky Diode Digikey: 641-1014-6-ND DO-1N4148 - Through Hole Small Current Diode SOD-123 20V 1 A (.5mV Vf) Schottky Diode - Digikey: MBRX120TPMSCT-ND SOD-323 10V 570mA (.38mV Vf, 3ns) Schottky Diode - Digikey: ZLLS410CT-ND SOD-523 30V 30mA Schottky Diode (RB751S-40TE61) - Digikey: RB751S-40TE61CT-ND SOT23-R/W - SOT23 Package (R = Solder Paste/Reflow Ovens, W = Hand-Soldering) BAT54Film 40V 300mA - Digikey: 497-7162-1-ND
D3 = diode:DIODE-: DIODE
F1 = rcl:L-EU: INDUCTOR, European symbol
IC1 IC6 = adafruit:MCP23017: http://ww1.microchip.com/downloads/en/DeviceDoc/21952a.pdf Source: http://ww1.microchip.com/downloads/en/DeviceDoc/21952a.pdf
IC2 = SmartPrj:LM2736Y
IC3 = microchip:24*00: Serial EEPROM 128 bit, I2C (AA = 1.8 V/LC = 2.5 V/C = 5.0 V); MF: MICROCHIP; MPN: 24AA00T-I/OTG; OC_FARNELL: 1331264; OC_NEWARK: 89H3038
IC4 = linear:MC33269ST*: Adjustable Output Low Dropout Voltage Regulator 800 mA Source: http://www.onsemi.com/pub/Collateral/MC33269-D.PDF
IC5 = adafruit:MCP73831: MCP73831/2 Miniature Single-Cell, Fully Integrated Li-Ion, Li-Polymer Charge Management Controllers. Nice and small simple lipoly charge controller, with adjustable current and status output (LED) http://www.ladyada.net/library/pcb/eaglelibrary.html
IC7 = linear:LMV321?*: General Purpose, Low Voltage, Rail-to-Rail Output Operational Amplifiers Source: http://www.national.com/mpf/LM/LMV321.html http://www.national.com/dt/lmv_qual.pdf
J1 = connector-hirose:DM3AT-SF-PEJM5: CONN MICRO SD R/A PUSH-PUSH SMD; DIGIKEY: HR1964CT-ND
JP2 = adafruit:PINHD-1X14: PIN HEADER
JTAG JTAG1 = Arduino_Wifi_shield_v018_tG:PINHEAD_PINHD-2X5: PIN HEADER
L1 L3 L6 = wuerth-elektronik:WE-CBF: SMD EMI Suppression Ferrite Beads - excellent anti-EMI properties - low DCR - impedances till 3000 ohms - rated current up to 6 A
L2 = rc-master-smd:L_: INDUCTOR
L4 = SmartPrj:L-US: INDUCTOR, American symbol
LED1-LED5 = adafruit:LED: LED OSRAM: - CHIPLED LG R971, LG N971, LY N971, LG Q971, LY Q971, LO R971, LY R971 LH N974, LH R974 LS Q976, LO Q976, LY Q976 LO Q996 - Hyper CHIPLED LW Q18S LB Q993, LB Q99A, LB R99A - SideLED LS A670, LO A670, LY A670, LG A670, LP A670 LB A673, LV A673, LT A673, LW A673 LH A674 LY A675 LS A676, LA A676, LO A676, LY A676, LW A676 LS A679, LY A679, LG A679 - Hyper Micro SIDELED® LS Y876, LA Y876, LO Y876, LY Y876 LT Y87S - SmartLED LW L88C, LW L88S LB L89C, LB L89S, LG L890 LS L89K, LO L89K, LY L89K LS L896, LA L896, LO L896, LY L896 - TOPLED LS T670, LO T670, LY T670, LG T670, LP T670 LSG T670, LSP T670, LSY T670, LOP T670, LYG T670 LG T671, LOG T671, LSG T671 LB T673, LV T673, LT T673, LW T673 LH T674 LS T676, LA T676, LO T676, LY T676, LB T676, LH T676, LSB T676, LW T676 LB T67C, LV T67C, LT T67C, LS T67K, LO T67K, LY T67K, LW E67C LS E67B, LA E67B, LO E67B, LY E67B, LB E67C, LV E67C, LT E67C LW T67C LS T679, LY T679, LG T679 LS T770, LO T770, LY T770, LG T770, LP T770 LB T773, LV T773, LT T773, LW T773 LH T774 LS E675, LA E675, LY E675, LS T675 LS T776, LA T776, LO T776, LY T776, LB T776 LHGB T686 LT T68C, LB T68C - Hyper Mini TOPLED® LB M676 - Mini TOPLED Santana® LG M470 LS M47K, LO M47K, LY M47K Source: http://www.osram.convergy.de/
MLX90614 = SparkFun-MLX:MLX90614: Melexis IR Thermometer
R1-R11 R23 R32 = rcl:R-EU_: RESISTOR, European symbol; SPICEPREFIX: R
R12-R22 R24 R25 R33 R34 R49-R54 = resistor:R-EU_: RESISTOR, European symbol
RJ45_MAIN_BOARD = RJ45 Jack:RJ45
RN1-RN4 RN7 = resistor-array:742-8_S: CTS 742 Series 8 Terminations, 4 Resistors
RN5 RN6 = resistor-array:742-8: CTS 742 Series 8 Terminations, 4 Resistors
T1 = zetex:PMOSSOT23: MOS FET; OC_FARNELL: unknown; OC_NEWARK: unknown
U1 U11 = SparkFun-IC-Microcontroller:ATSAMD21G: Atmel SAMD21G SMART ARM-Based Microcontroller The Atmel ® | SMART ™ SAM D21 is a series of low-power microcontrollers using the 32-bit ARM ® Cortex ® -M0+ processor, and ranging from 32- to 64-pins with up to 256KB Flash and 32KB of SRAM. The SAM D21 devices operate at a maximum frequency of 48MHz and reach 2.46 CoreMark/MHz. They are designed for simple and intuitive migration with identical peripheral modules, hex compatible code, identical linear address map and pin compatible migration paths between all devices in the product series. All devices include intelligent and flexible peripherals, Atmel Event System for inter-peripheral signaling, and support for capacitive touch button, slider and wheel user interfaces. Datasheet <https://cdn.sparkfun.com/datasheets/Dev/Arduino/Boards/Atmel-42181-SAM-D21_Datasheet.pdf> SparkFun Products SparkFun SAMD21 Mini Breakout <https://www.sparkfun.com/products/13664> (DEV-13664) SparkFun SAMD21 Dev Breakout <https://www.sparkfun.com/products/13672> (DEV-13672) (DEV-14926); PROD_ID: IC-13064
U2 = Volks73-NXPSemiconductors:PRTR5V0U2X?: I2C-Bus EDS Protection Ulta low capacitance double rail-to-rail ESD protection diode Documentation Datasheet <http://www.nxp.com/documents/data_sheet/PRTR5V0U2X.pdf> General Description Ultra low capacitance rail-to-rail ElectroStatic Discharge (ESD) protection diode in a small SOT143B Surface-Mounted Device (SMD) plastic package designed to protect two Hi-Speed data lines or high-frequency signal lines from the damage caused by ESD and other transients. PRTR5V0U2X incorporates two pairs of ultra low capacitance rail-to-rail diodes as well as an additional ESD protection diode to ensure signal line protection even if no supply voltage is available. Features ESD protection of two Hi-Speed data lines or high-frequency signal lines Ultra low input/output to ground capacitance: C(I/O-GND) = 1 pF ESD protection up to 8kV IEC 61000-4-2, level 4 (ESD) Very low clamping voltage due to an integrated additional ESD protection diode Very low reverse current Small SMD plastic package Applications USB 2.0 ports Digital Video Interface (DVI)/High Definition Multimedia Interface (HDMI) interfaces Mobile and cordless phones Personal Digital Assistants (PDA) Digital Cameras Wide Area Network (WAN) / Local Area Network (LAN) systems PCs, notebooks, printers, and other PC peripherals; APPLICATIONS: General Purpose; BIDIRECTIONAL_CHANNELS: 2; CAPACITANCE: 1pF @ 1MHz; CURRENT_PEAK_PULSE: -; DESCRIPTION: TVS DIODE 5.5VWM SOT143B; DOCUMENTATION_LINK: <a href="http://www.nxp.com/documents/data_sheet/PRTR5V0U2X.pdf">Datasheet</a>; DOCUMENTATION_URL: http://www.nxp.com/documents/data_sheet/PRTR5V0U2X.pdf; MANUFACTURER: NXP Semiconductors; MOUNTING_TYPE: Surface Mount; OPERATING_TEMPERATURE: -40C ~ 85C; PART_NUMBER: PRTR5V0U2X,215; POWER-PEAK_PULSE: -; POWER_LINE_PROTECTION: Yes; SUPPLIER_ITEM_LINK: <a href="http://www.digikey.com/product-detail/en/PRTR5V0U2X,215/568-4140-1-ND/1589981">Details</a>; SUPPLIER_ITEM_NUMBER: 568-4140-1-ND; SUPPLIER_ITEM_URL: http://www.digikey.com/product-detail/en/PRTR5V0U2X,215/568-4140-1-ND/1589981; SUPPLIER_LINK: <a href="http://www.digikey.com">Home Page</a>; SUPPLIER_NAME: Digi-Key; SUPPLIER_URL: http://www.digikey.com; TYPE: Steering (Rail to Rail); UNIDIRECTIONAL_CHANNELS: -; VOLTAGE_BREAKDOWN: 6V; VOLTAGE_CLAMPING: -; VOLTAGE_REVERSE: 5.5V
U3 = 74ah:74AHC1G125: TRI-STATE SINGLE BUSS BUFFER
U4 = Testing:MPU-9250: NC pin 19. 2-6 & 14-17 not internally connected. May be used for PCB trace routing.; PROD_ID: IC-13192
U5 U7 U9 U10 = TI:P82B96D: DUAL BIDIRECTIONAL BUS BUFFER; MPN: P82B96D; OC_FARNELL: 1831235; OC_NEWARK: 88K6383; PACKAGE: SOIC-8; SUPPLIER: Texas Instruments
U6 = microbuilder:VREG_SOT23-5: SOT23-5 Fixed Voltage Regulators Part Current Out V Out V In V Dropout θJA (°C/W) TJ (°C) Digikey Part No. ADP121 150mA 3.3V 3.4-5.5V 0.09V @ 150mA -- -- ADP121-AUJZ33R7CT-ND ADP121 150mA 3.0V 3.1-5.5V 0.09V @ 150mA -- -- ADP121-AUJZ30R7CT-ND ADP122 300mA 3.3V 3.4-5.5V 0.085V @ 300mA -- -- ADP122AUJZ-3.3-R7CT-ND ADP1712 300mA 3.3V 3.5-5.5V 0.17V @ 300mA -- -- ADP1712AUJZ-3.3-R7TR-ND AP7311 (Low Cost) 150mA 3.3V 3.5-6V 0.15V @ 150mA -- -- AP7311-33WG-7DICT-ND LD39015M18R 150mA 1.8V 1.9V-5.5V 0.08V @ 100mA -- -- 497-6977-1-ND LP2985A-33DBVR 150mA 3.3V 3.3-16V 0.28V @ 150mA 206 150 296-18479-1-ND MCP1824T-3302E/OT 300mA 3.3V 3.5V-6V 0.2V @ 300mA -- -- MCP1824T-3302E/OTCT-ND MIC5205-2.5YM5 TR 150mA 2.5V 2.7-16V 0.165V @ 150mA -- -- 576-1257-2-ND MIC5205-3.0YM5 TR 150mA 3.0V 3.2V-16V 0.165V @ 150mA -- -- 576-1258-2-ND MIC5205-3.3YM5 TR 150mA 3.3V 3.5V-16V 0.165V @ 150mA -- -- 576-1259-2-ND TPS780330220 150mA 3.3V+2.2V 3.6-5.5V 250mV Max -- -- 296-23332-1-ND TDA3663/N1,135 100mA 3.3V 3.5-45V 0.18V @ 50mA -- -- 568-5343-1-ND Max operating temp can be calculated using θJA, TJ (max junction temperature), and power in watts. Set the "Maximum Ambient Temperature" until it reaches TJ ("Max Junction Temperature"), which is the absolute limit for safe use of the regulator: Heat Sink Temperature Calculator <http://www.daycounter.com/Calculators/Heat-Sink-Temperature-Calculator.phtml> For example, With 12V source into a 3.3V LP2985 and a 30mA load, we are dissipating (12V-3.3V) * 0.03A = 0.261W. With a θJA of 206 °C/W, a TJ of 150°C, and 261mW we can safely use the chip without a heat sink up to 75°C (=147.1°C Junction Temperature).
U8 = TI:TLV2374IPWR: OPERATIONAL AMPLIFIERS; MPN: TLV2374IPWR; OC_FARNELL: 1575640; OC_NEWARK: 76C7986; PACKAGE: SOIC-14; SUPPLIER: Texas Instruments
U12 U13 = TI:SN74LVC2G17DBVR: DUAL SCHMITT-TRIGGER BUFFER; MPN: SN74LVC2G17DBVR; OC_FARNELL: 1470776; OC_NEWARK: 76C4207; PACKAGE: SOT-23-6; SUPPLIER: Texas Instruments
U14 = TI:CD40106BPW: QUADRUPLE FET BUS SWITCH 2.5-V/3.3-V LOW-VOLTAGE BUS SWITCH WITH 5-V-TOLERANT LEVEL SHIFTER; MPN: CD40106BPW; OC_FARNELL: 1741145; OC_NEWARK: 34R6794; PACKAGE: TSSOP-14; SUPPLIER: Texas Instruments
U$1 U$14 = kanflo:OSCILLATOR_32KHZ: CM7V-T1A Tuning Fork Crystal 32.768 kHz
U$2 = hm-11:HM-11: JNHuaMao HM-11 Bluetooth 4.0 Transceiver based on TI CC2540/CC2541
U$3 = ubloxLib:NEO-M8: u-blox NEO GNSS module
U$4 = DAWA:TFT_2.4
U$5-U$8 = DAWA:SKPMAPE10
U$9 U$15 = JST-XH_HEADERS:4_PIN_JST-XH-SMD
U$16 = DAWA:UG-2864HSWEG01: UG-2864HSWEG01 OLED display
U$17 = DAWA:LI_3.6
U$18 = RJ45 Jack:RJ45X8
X1 = adafruit:SMACONNECTOR: SMA Connector 90° DIP SMA Connector, 50 Ohm (4UConnector: 07259)

## Net classes
0 default: width 0.203 mm, drill 0.406 mm, clearance 0.203 mm
3 usbvcc: width 0.203 mm, drill 0.406 mm, clearance 0.203 mm
4 USBpair: width 0.254 mm, drill 0.406 mm, clearance 0.61 mm